# EAGLE design Raspberry Pi IMU shield_vFinal (EAGLE 8.7.0)
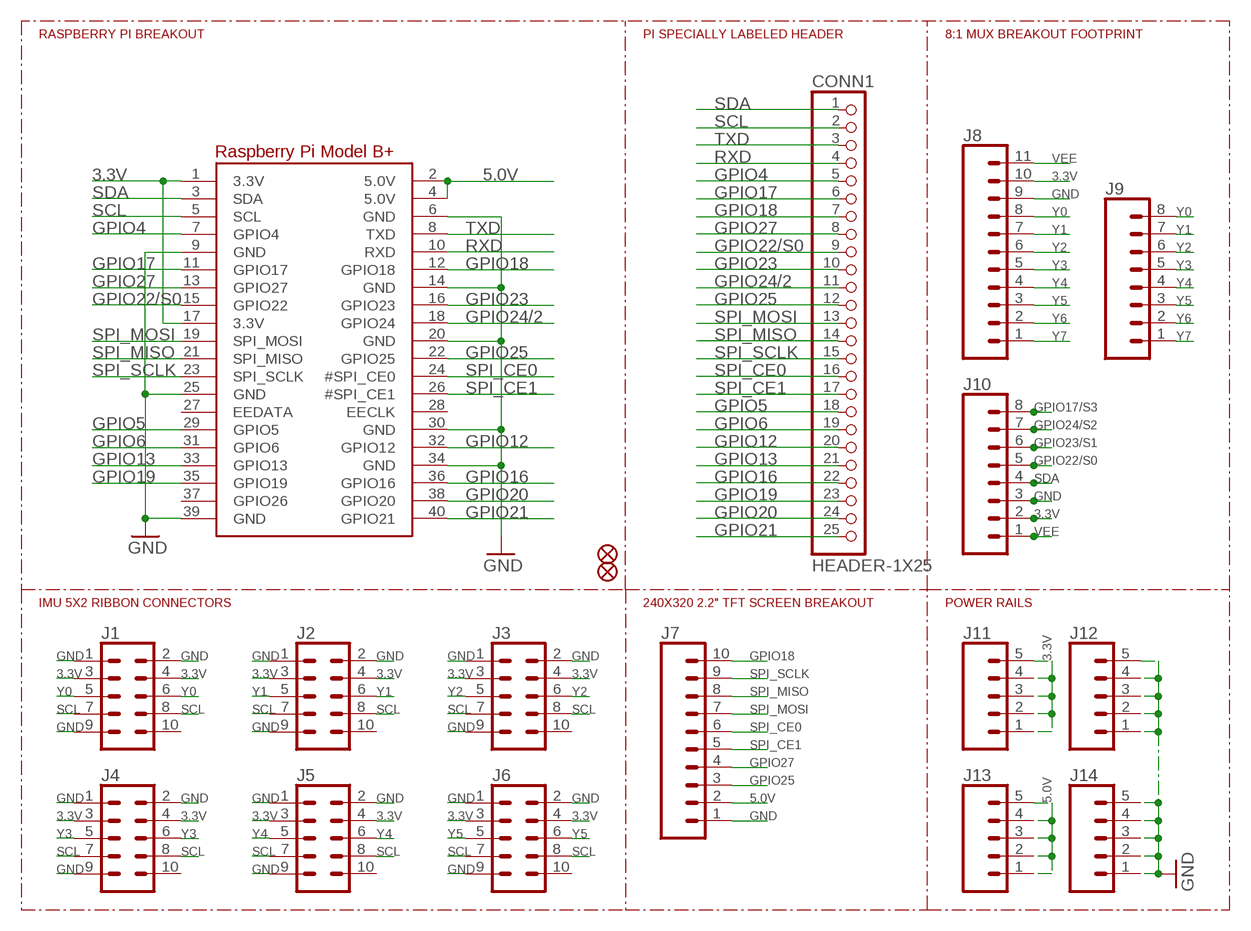
[diagram p0: schematic, sheet 1]

## Parts
CONN1  HEADER-1X25  [1X25_ROUND_70MIL]
FID2  FIDUCIAL""  [FIDUCIAL_1MM]
FID3  FIDUCIAL""  [FIDUCIAL_1MM]
J1  CONN_05X2SHD  [2X5-SHROUDED]
J2  CONN_05X2SHD  [2X5-SHROUDED]
J3  CONN_05X2SHD  [2X5-SHROUDED]
J4  CONN_05X2SHD  [2X5-SHROUDED]
J5  CONN_05X2SHD  [2X5-SHROUDED]
J6  CONN_05X2SHD  [2X5-SHROUDED]
J7  CONN_10LOCK  [1X10_LOCK]
J8  CONN_111X11_NO_SILK_KIT  [1X11_NO_SILK_KIT]
J9  CONN_08NO_SILK_FEMALE_PTH  [1X08_NO_SILK]
J10  CONN_08NO_SILK_FEMALE_PTH  [1X08_NO_SILK]
J11  CONN_05  [1X05]
J12  CONN_05  [1X05]
J13  CONN_05  [1X05]
J14  CONN_05  [1X05]
RPI1  RASPBERRYPI_BPLUS_HATNOSLOTS  [PI_HAT_NOSLOTS]

## Nets
3.3V [power]: J1.3 J1.4 J2.3 J2.4 J3.3 J3.4 J4.3 J4.4 J5.3 J5.4 J6.3 J6.4 J8.10 J10.2 J11.1 J11.2 J11.3 J11.4 J11.5 RPI1.1(3.3V) RPI1.17(3.3V)
5.0V [power]: J7.2 J13.1 J13.2 J13.3 J13.4 J13.5 RPI1.2(5.0V) RPI1.4(5.0V)
GND [power]: J1.1 J1.2 J1.9 J2.1 J2.2 J2.9 J3.1 J3.2 J3.9 J4.1 J4.2 J4.9 J5.1 J5.2 J5.9 J6.1 J6.2 J6.9 J7.1 J8.9 J10.3 J12.1 J12.2 J12.3 J12.4 J12.5 J14.1 J14.2 J14.3 J14.4 J14.5 RPI1.6(GND) RPI1.9(GND) RPI1.14(GND) RPI1.20(GND) RPI1.25(GND) RPI1.30(GND) RPI1.34(GND) RPI1.39(GND)
GPIO4: CONN1.5 RPI1.7(GPIO4)
GPIO5: CONN1.18 RPI1.29(GPIO5)
GPIO6: CONN1.19 RPI1.31(GPIO6)
GPIO12: CONN1.20 RPI1.32(GPIO12)
GPIO13: CONN1.21 RPI1.33(GPIO13)
GPIO16: CONN1.22 RPI1.36(GPIO16)
GPIO17: CONN1.6 RPI1.11(GPIO17)
GPIO17/S3: J10.8
GPIO18: CONN1.7 J7.10 RPI1.12(GPIO18)
GPIO19: CONN1.23 RPI1.35(GPIO19)
GPIO20: CONN1.24 RPI1.38(GPIO20)
GPIO21: CONN1.25 RPI1.40(GPIO21)
GPIO22/S0: CONN1.9 J10.5 RPI1.15(GPIO22)
GPIO23: CONN1.10 RPI1.16(GPIO23)
GPIO23/S1: J10.6
GPIO24/2: CONN1.11 RPI1.18(GPIO24)
GPIO24/S2: J10.7
GPIO25: CONN1.12 J7.3 RPI1.22(GPIO25)
GPIO27: CONN1.8 J7.4 RPI1.13(GPIO27)
RXD: CONN1.4 RPI1.10(RXD)
SCL: CONN1.2 J1.7 J1.8 J2.7 J2.8 J3.7 J3.8 J4.7 J4.8 J5.7 J5.8 J6.7 J6.8 RPI1.5(SCL)
SDA: CONN1.1 J10.4 RPI1.3(SDA)
SPI_CE0: CONN1.16 J7.6 RPI1.24(#SPI_CE0)
SPI_CE1: CONN1.17 J7.5 RPI1.26(#SPI_CE1)
SPI_MISO: CONN1.14 J7.8 RPI1.21(SPI_MISO)
SPI_MOSI: CONN1.13 J7.7 RPI1.19(SPI_MOSI)
SPI_SCLK: CONN1.15 J7.9 RPI1.23(SPI_SCLK)
TXD: CONN1.3 RPI1.8(TXD)
VEE [power]: J8.11 J10.1
Y0 [power]: J1.5 J1.6 J8.8 J9.8
Y1 [power]: J2.5 J2.6 J8.7 J9.7
Y2 [power]: J3.5 J3.6 J8.6 J9.6
Y3 [power]: J4.5 J4.6 J8.5 J9.5
Y4 [power]: J5.5 J5.6 J8.4 J9.4
Y5 [power]: J6.5 J6.6 J8.3 J9.3
Y6 [power]: J8.2 J9.2
Y7 [power]: J8.1 J9.1
Unconnected: J1.10 J2.10 J3.10 J4.10 J5.10 J6.10 RPI1.27(EEDATA) RPI1.28(EECLK) RPI1.37(GPIO26)

## Notes on the sheet
- RASPBERRY PI BREAKOUT | PI SPECIALLY LABELED HEADER | 8:1 MUX BREAKOUT FOOTPRINT
- IMU 5X2 RIBBON CONNECTORS | 240X320 2.2" TFT SCREEN BREAKOUT | POWER RAILS

## Library data of the parts
CONN1 = microbuilder:HEADER-1X25
FID2 FID3 = microbuilder:FIDUCIAL: Fiducial Alignment Points Various fiducial points for machine vision alignment.; BOM: EXCLUDE
J1-J6 = SparkFun-Connectors:CONN_05X2: Multi connection point. Often used as Generic Header-pin footprint for 0.1 inch spaced/style header connections For AVR SPI programming port, see special device with nice symbol: "AVR_SPI_PROG_5x2.dev" You can populate with any combo of single row headers, but if you'd like an exact match, check these: 2x5 AVR ICSP Male Header <https://www.sparkfun.com/products/778> (PRT-00778) 2x5 Pin Shrouded Header <https://www.sparkfun.com/products/8506> (PRT-08506) On any of the 0.1 inch spaced packages, you can populate with these: Break Away Headers - Straight <https://www.sparkfun.com/products/116> (PRT-00116) Break Away Male Headers - Right Angle <https://www.sparkfun.com/products/553> (PRT-00553) Female Headers <https://www.sparkfun.com/products/115> (PRT-00115) Break Away Headers - Machine Pin <https://www.sparkfun.com/products/117> (PRT-00117) Break Away Female Headers - Swiss Machine Pin <https://www.sparkfun.com/products/743> (PRT-00743) Special note: the shrouded connector mates well with our 5x2 ribbon cables: 2x5 Pin IDC Ribbon Cable <https://www.sparkfun.com/products/8535> (PRT-08535); PROD_ID: CONN-08671; SF_ID: PRT-08506
J7 = SparkFun-Connectors:CONN_10: Multi connection point. Often used as Generic Header-pin footprint for 0.1 inch spaced/style header connections On any of the 0.1 inch spaced packages, you can populate with these: Break Away Headers - Straight <https://www.sparkfun.com/products/116> (PRT-00116) Break Away Male Headers - Right Angle <https://www.sparkfun.com/products/553> (PRT-00553) Female Headers <https://www.sparkfun.com/products/115> (PRT-00115) Break Away Headers - Machine Pin <https://www.sparkfun.com/products/117> (PRT-00117) Break Away Female Headers - Swiss Machine Pin <https://www.sparkfun.com/products/743> (PRT-00743) Arduino Stackable Header - 10 Pin <https://www.sparkfun.com/products/11376> (PRT-11376) For SCREWTERMINALS and SPRING TERMINALS visit here: Screw Terimnals on SparkFun.com <https://www.sparkfun.com/search/results?term=Screw+Terminals> (5mm/3.5mm/2.54mm spacing) This device is also useful as a general connection point to wire up your design to another part of your project. Our various solder wires solder well into these plated through hole pads. Hook-Up Wire - Assortment (Stranded, 22 AWG) <https://www.sparkfun.com/products/11375> (PRT-11375) Hook-Up Wire - Assortment (Solid Core, 22 AWG) <https://www.sparkfun.com/products/11367> (PRT-11367) View the entire wire category on our website here <https://www.sparkfun.com/categories/141> Special notes: Molex polarized connector foot print use with SKU : PRT-08231 with associated crimp pins and housings. 1MM SMD Version SKU: PRT-10208 NOTES ON THE VARIANTS LOCK and LOCK_LONGPADS... This footprint was designed to help hold the alignment of a through-hole component (i.e. 6-pin header) while soldering it into place. You may notice that each hole has been shifted either up or down by 0.005 of an inch from it's more standard position (which is a perfectly straight line). This slight alteration caused the pins (the squares in the middle) to touch the edges of the holes. Because they are alternating, it causes a "brace" to hold the component in place. 0.005 has proven to be the perfect amount of "off-center" position when using our standard breakaway headers. Although looks a little odd when you look at the bare footprint, once you have a header in there, the alteration is very hard to notice. Also,if you push a header all the way into place, it is covered up entirely on the bottom side.
J8 = SparkFun-Connectors:CONN_11: Multi connection point. Often used as Generic Header-pin footprint for 0.1 inch spaced/style header connections On any of the 0.1 inch spaced packages, you can populate with these: Break Away Headers - Straight <https://www.sparkfun.com/products/116> (PRT-00116) Break Away Male Headers - Right Angle <https://www.sparkfun.com/products/553> (PRT-00553) Female Headers <https://www.sparkfun.com/products/115> (PRT-00115) Break Away Headers - Machine Pin <https://www.sparkfun.com/products/117> (PRT-00117) Break Away Female Headers - Swiss Machine Pin <https://www.sparkfun.com/products/743> (PRT-00743) For SCREWTERMINALS and SPRING TERMINALS visit here: Screw Terimnals on SparkFun.com <https://www.sparkfun.com/search/results?term=Screw+Terminals> (5mm/3.5mm/2.54mm spacing) This device is also useful as a general connection point to wire up your design to another part of your project. Our various solder wires solder well into these plated through hole pads. Hook-Up Wire - Assortment (Stranded, 22 AWG) <https://www.sparkfun.com/products/11375> (PRT-11375) Hook-Up Wire - Assortment (Solid Core, 22 AWG) <https://www.sparkfun.com/products/11367> (PRT-11367) View the entire wire category on our website here <https://www.sparkfun.com/categories/141>
J9 J10 = SparkFun-Connectors:CONN_08: Multi connection point. Often used as Generic Header-pin footprint for 0.1 inch spaced/style header connections On any of the 0.1 inch spaced packages, you can populate with these: Break Away Headers - Straight <https://www.sparkfun.com/products/116> (PRT-00116) Break Away Male Headers - Right Angle <https://www.sparkfun.com/products/553> (PRT-00553) Female Headers <https://www.sparkfun.com/products/115> (PRT-00115) Break Away Headers - Machine Pin <https://www.sparkfun.com/products/117> (PRT-00117) Break Away Female Headers - Swiss Machine Pin <https://www.sparkfun.com/products/743> (PRT-00743) Arduino Stackable Header - 8 Pin <https://www.sparkfun.com/products/9279> (PRT-09279) For SCREWTERMINALS and SPRING TERMINALS visit here: Screw Terimnals on SparkFun.com <https://www.sparkfun.com/search/results?term=Screw+Terminals> (5mm/3.5mm/2.54mm spacing) This device is also useful as a general connection point to wire up your design to another part of your project. Our various solder wires solder well into these plated through hole pads. Hook-Up Wire - Assortment (Stranded, 22 AWG) <https://www.sparkfun.com/products/11375> (PRT-11375) Hook-Up Wire - Assortment (Solid Core, 22 AWG) <https://www.sparkfun.com/products/11367> (PRT-11367) View the entire wire category on our website here <https://www.sparkfun.com/categories/141> Special notes: Molex polarized connector foot print use with SKU : PRT-08231 with associated crimp pins and housings. 1MM SMD Version SKU: PRT-10208 NOTES ON THE VARIANTS LOCK and LOCK_LONGPADS... This footprint was designed to help hold the alignment of a through-hole component (i.e. 6-pin header) while soldering it into place. You may notice that each hole has been shifted either up or down by 0.005 of an inch from it's more standard position (which is a perfectly straight line). This slight alteration caused the pins (the squares in the middle) to touch the edges of the holes. Because they are alternating, it causes a "brace" to hold the component in place. 0.005 has proven to be the perfect amount of "off-center" position when using our standard breakaway headers. Although looks a little odd when you look at the bare footprint, once you have a header in there, the alteration is very hard to notice. Also,if you push a header all the way into place, it is covered up entirely on the bottom side.; PROD_ID: CONN-08438
J11-J14 = SparkFun-Connectors:CONN_05: Multi connection point. Often used as Generic Header-pin footprint for 0.1 inch spaced/style header connections On any of the 0.1 inch spaced packages, you can populate with these: Break Away Headers - Straight <https://www.sparkfun.com/products/116> (PRT-00116) Break Away Male Headers - Right Angle <https://www.sparkfun.com/products/553> (PRT-00553) Female Headers <https://www.sparkfun.com/products/115> (PRT-00115) Break Away Headers - Machine Pin <https://www.sparkfun.com/products/117> (PRT-00117) Break Away Female Headers - Swiss Machine Pin <https://www.sparkfun.com/products/743> (PRT-00743) For SCREWTERMINALS and SPRING TERMINALS visit here: Screw Terimnals on SparkFun.com <https://www.sparkfun.com/search/results?term=Screw+Terminals> (5mm/3.5mm/2.54mm spacing) This device is also useful as a general connection point to wire up your design to another part of your project. Our various solder wires solder well into these plated through hole pads. Hook-Up Wire - Assortment (Stranded, 22 AWG) <https://www.sparkfun.com/products/11375> (PRT-11375) Hook-Up Wire - Assortment (Solid Core, 22 AWG) <https://www.sparkfun.com/products/11367> (PRT-11367) View the entire wire category on our website here <https://www.sparkfun.com/categories/141> Special notes: Molex polarized connector foot print use with SKU : PRT-08231 with associated crimp pins and housings. 1MM SMD Version SKU: PRT-10208
RPI1 = microbuilder:RASPBERRYPI_BPLUS

## Net classes
0 default: width 0.254 mm, clearance 0.203 mm
1 power: width 0.406 mm, clearance 0.203 mm

## Board
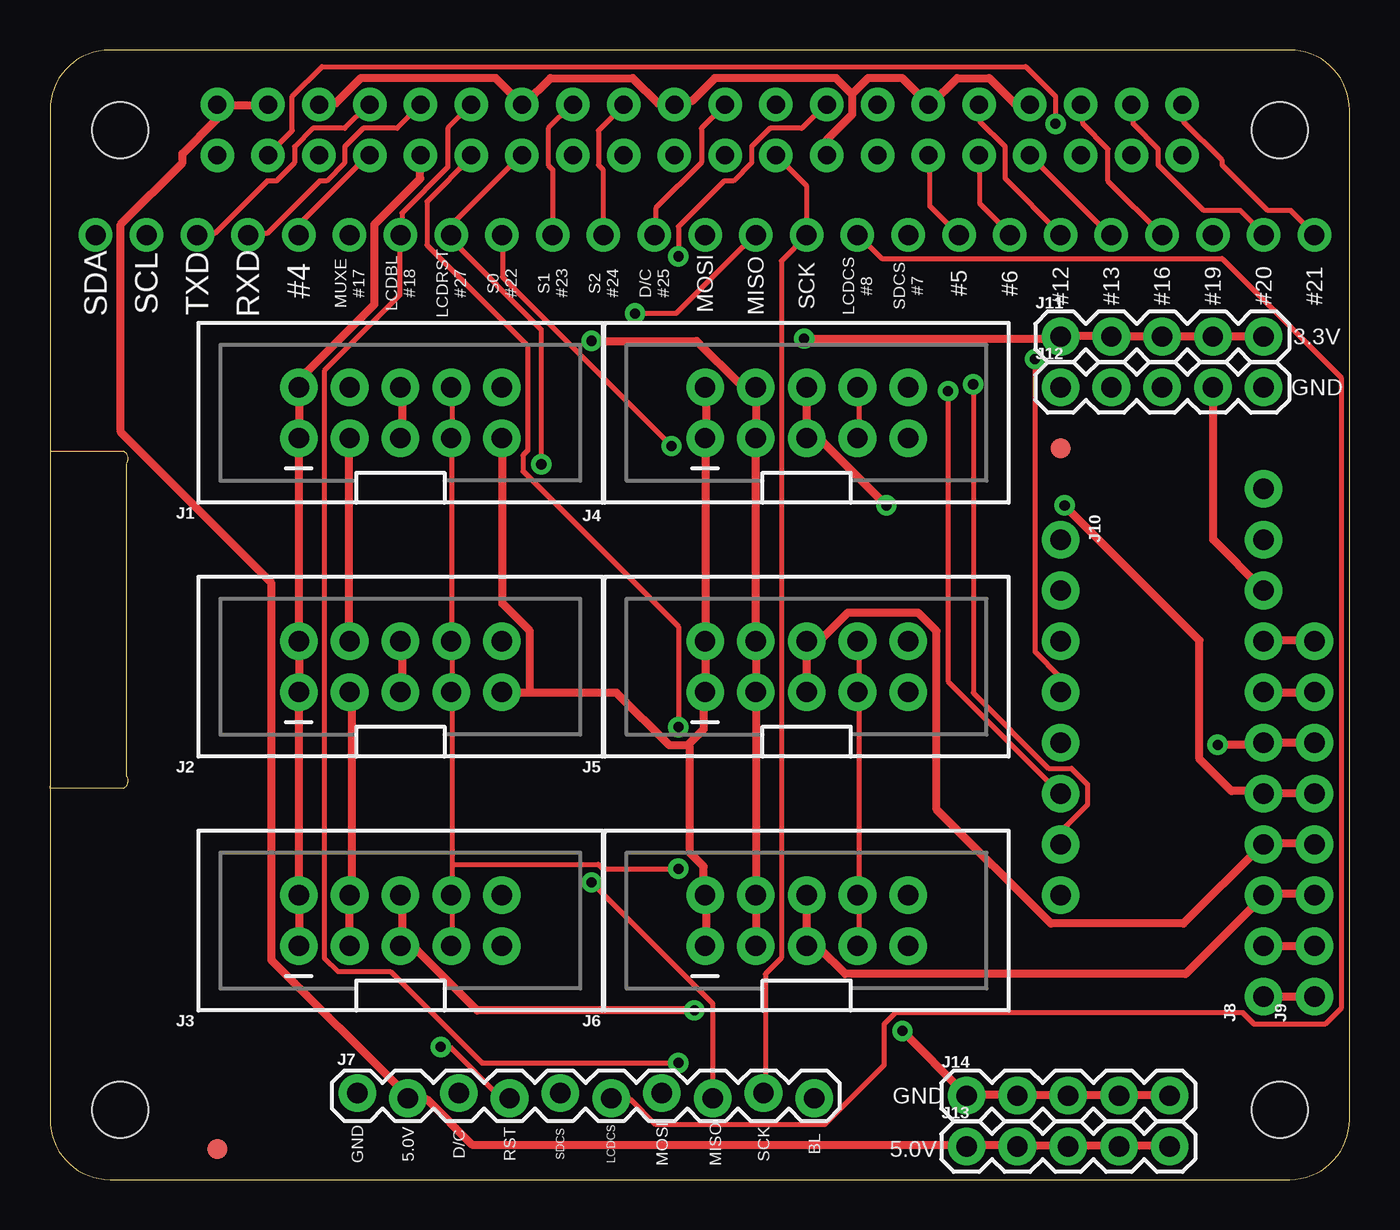
[diagram p1: board, top side]
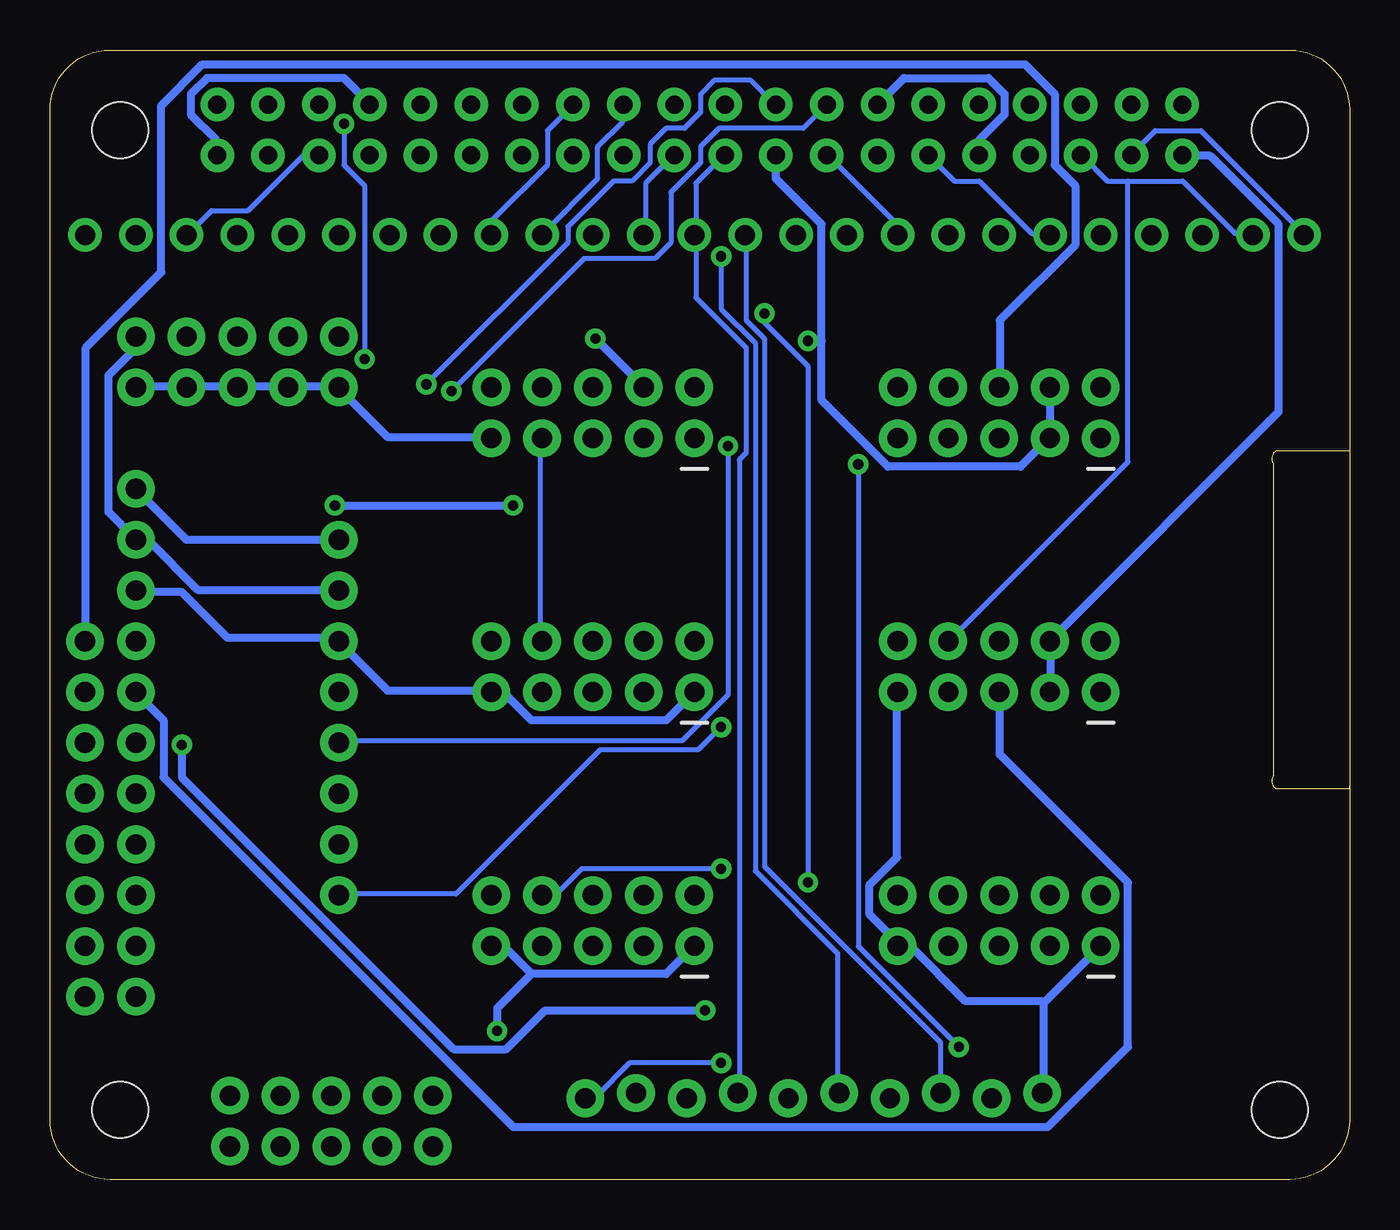
[diagram p2: board, bottom side, seen from below]

Size 65 x 56.5 mm. Coordinates in mm from the lower left corner, seen from the top.
Outline: 0,36.45 3.68,36.45 arc-90 3.81,35.81 3.81,20.19 arc-90 3.68,19.56 0,19.56 0,19.68
Copper layers (1*16): Top 0.035mm / dielectric 1.5mm / Bottom 0.035mm
Design rules "SparkFun": minimum track width 8mil, minimum drill 20mil, track to track 8mil, track to pad 8mil, pad to pad 8mil, via to via 8mil, smd to smd 8mil, copper to edge 10mil, drill to drill 8mil, minimum pad ring 12mil, minimum via ring 10mil, stop-mask expansion 4mil, vias tented up to drill 25mil, thermal gap 10mil

### Footprints (pad centres in the part's own frame; a part is rotated, then mirrored left to right if it is on the bottom)
1X25_ROUND_70MIL = drill 1 pad 1.676: 1 -30.48,0; 2 -27.94,0; 3 -25.4,0; 4 -22.86,0; 5 -20.32,0; 6 -17.78,0; 7 -15.24,0; 8 -12.7,0; 9 -10.16,0; 10 -7.62,0; 11 -5.08,0; 12 -2.54,0; 13 0,0; 14 2.54,0; 15 5.08,0; 16 7.62,0; 17 10.16,0; 18 12.7,0; 19 15.24,0; 20 17.78,0; 21 20.32,0; 22 22.86,0; 23 25.4,0; 24 27.94,0; 25 30.48,0
FIDUCIAL_1MM = smd 1 x 1: 1 0,0
2X5-SHROUDED = drill 1.016 pad 1.88: 1 -1.27,5.08; 2 1.27,5.08; 3 -1.27,2.54; 4 1.27,2.54; 5 -1.27,0; 6 1.27,0; 7 -1.27,-2.54; 8 1.27,-2.54; 9 -1.27,-5.08; 10 1.27,-5.08
1X10_LOCK = drill 1.016 pad 1.88: 1 0,0.127; 2 2.54,-0.127; 3 5.08,0.127; 4 7.62,-0.127; 5 10.16,0.127; 6 12.7,-0.127; 7 15.24,0.127; 8 17.78,-0.127; 9 20.32,0.127; 10 22.86,-0.127
1X11_NO_SILK_KIT = drill 1.016 pad 1.88: 1 0,0; 2 2.54,0; 3 5.08,0; 4 7.62,0; 5 10.16,0; 6 12.7,0; 7 15.24,0; 8 17.78,0; 9 20.32,0; 10 22.86,0; 11 25.4,0
1X08_NO_SILK = drill 1.016 pad 1.88: 1 0,0; 2 2.54,0; 3 5.08,0; 4 7.62,0; 5 10.16,0; 6 12.7,0; 7 15.24,0; 8 17.78,0
1X05 = drill 1.016 pad 1.88: 1 0,0; 2 2.54,0; 3 5.08,0; 4 7.62,0; 5 10.16,0
PI_HAT_NOSLOTS = drill 0.9 pad 1.676: 1 8.37,51.23; 2 8.37,53.77; 3 10.91,51.23; 4 10.91,53.77; 5 13.45,51.23; 6 13.45,53.77; 7 15.99,51.23; 8 15.99,53.77; 9 18.53,51.23; 10 18.53,53.77; 11 21.07,51.23; 12 21.07,53.77; 13 23.61,51.23; 14 23.61,53.77; 15 26.15,51.23; 16 26.15,53.77; 17 28.69,51.23; 18 28.69,53.77; 19 31.23,51.23; 20 31.23,53.77; 21 33.77,51.23; 22 33.77,53.77; 23 36.31,51.23; 24 36.31,53.77; 25 38.85,51.23; 26 38.85,53.77; 27 41.39,51.23; 28 41.39,53.77; 29 43.93,51.23; 30 43.93,53.77; 31 46.47,51.23; 32 46.47,53.77; 33 49.01,51.23; 34 49.01,53.77; 35 51.55,51.23; 36 51.55,53.77; 37 54.09,51.23; 38 54.09,53.77; 39 56.63,51.23; 40 56.63,53.77 | hole 2.8: 3.5,3.5; 3.5,52.5; 61.5,52.5; 61.5,3.5

### Placement (x,y rotation side)
CONN1  32.77,47.24 0 top
FID2  8.38,1.52 0 top
FID3  50.55,36.58 0 top
J1  17.53,38.35 90 top
J2  17.53,25.65 90 top
J3  17.53,12.95 90 top
J4  37.85,38.35 90 top
J5  37.85,25.65 90 top
J6  37.85,12.95 90 top
J7  15.37,4.19 0 top
J8  60.71,9.14 90 top
J9  63.25,9.14 90 top
J10  50.55,32 270 top
J11  50.55,42.16 0 top
J12  50.55,39.62 0 top
J13  45.85,1.65 0 top
J14  45.85,4.19 0 top
RPI1  0,0 0 top

### Tracks (layer width: path | path; a pad name or v marks a point on that pad's centre or on a via)
3.3V  (via drill 0.51)
  Top 0.406: J11.5 60.69,42.18 58.29,42.18 J11.4 58.06,42.18 55.78,42.18 J11.3 55.55,42.18 53.26,42.18 J11.2 53.03,42.18 50.63,42.18 J11.1 50.41,42.06 v37.72,42.06 | J6.3 35.32,11.77 35.32,14.17 J6.4 35.32,14.4 35.32,24.23 J5.3 35.32,24.46 35.32,26.86 J5.4 35.32,27.09 35.32,36.92 J4.3 35.32,37.15 35.32,39.55 J4.4 35.2,39.78 34.52,39.78 32.35,41.95 v27.09,41.95 | J3.3 14.97,11.77 14.97,14.17 J3.4 15.09,14.4 15.09,24.35 J2.3 | J1.3 14.97,37.03 14.97,26.98 J2.4
  Bottom 0.406: J10.2 50.63,29.49 57.61,29.49 60.12,32 J8.10 60.81,32.12 62.06,33.38 62.06,40.23 60.81,41.49 60.81,42.06 J11.5 | v37.72,42.06 35.32,39.66 J4.4 | 26.4,41.95 26.4,38.98 23.09,35.66 16.46,35.66 15.09,37.03 J1.3 14.97,37.26 14.97,39.55 J1.4 | 26.4,41.95 26.4,47.78 28.69,50.06 28.69,51.21 RPI1.17 | RPI1.1 8.34,51.21 6.97,51.21 3.54,47.78 3.54,38.41 14.97,26.98 J2.4 14.97,26.75 14.97,24.46 J2.3 | 26.4,41.95 v27.09,41.95
5.0V
  Top 0.406: RPI1.4 10.86,53.72 8.46,53.72 RPI1.2 8.34,53.61 8.34,53.03 6.63,51.32 6.63,50.86 3.54,47.78 3.54,37.38 11.09,29.83 11.09,10.97 17.83,4.23 J7.2 17.95,4 18.86,4 21.14,1.71 45.72,1.71 J13.1 45.95,1.71 48.35,1.71 J13.2 48.58,1.71 50.86,1.71 J13.3 51.09,1.71 53.38,1.71 J13.4 53.61,1.71 56.01,1.71 J13.5
GND  (via drill 0.51)
  Top 0.406: J12.4 58.18,39.55 58.18,32 60.69,29.49 J8.9 | J4.2 32.8,39.55 32.8,37.15 J4.1 32.8,36.92 32.8,27.09 J5.2 32.8,26.86 32.8,24.57 J5.1 32.69,24.35 32.69,22.52 31.89,21.72 | 24,24.35 28.35,24.35 30.98,21.72 31.89,21.72 | 24,24.35 22.63,24.35 J2.9 | 24,24.35 24,27.43 22.63,28.8 22.63,37.03 J1.9 | J14.5 56.01,4.23 53.61,4.23 J14.4 53.38,4.23 51.09,4.23 J14.3 50.86,4.23 48.58,4.23 J14.2 48.35,4.23 45.95,4.23 J14.1 45.72,4.34 v42.63,7.43 | J6.1 32.8,11.77 32.8,14.17 J6.2 32.69,14.4 32.69,15.66 32,16.34 32,21.6 31.89,21.72 | RPI1.6 13.49,53.84 14.29,53.84 15.54,55.09 22.29,55.09 23.55,53.84 RPI1.14 23.77,53.84 25.03,55.09 29.15,55.09 30.4,53.84 31.2,53.84 RPI1.20 31.32,53.95 32.12,53.95 33.26,55.09 39.32,55.09 40.12,54.29 | 40.12,54.29 40.12,53.26 38.86,52.01 38.86,51.32 RPI1.25 | 40.12,54.29 40.92,55.09 42.63,55.09 43.89,53.84 RPI1.30 44.12,53.84 45.38,55.09 46.98,55.09 48.23,53.84 48.92,53.84 RPI1.34 | J3.1 12.46,11.77 12.46,14.17 J3.2 12.46,14.4 12.46,24.23 J2.1 12.46,24.46 12.46,26.86 J2.2 12.46,27.09 12.46,36.92 J1.1 12.46,37.15 12.46,39.55 J1.2 12.57,39.78 12.57,40.12 16.23,43.78 16.23,47.78 18.52,50.06 18.52,51.21 RPI1.9
  Bottom 0.406: J4.9 42.98,37.15 48.12,37.15 50.52,39.55 J12.1 50.75,39.66 53.03,39.66 J12.2 53.26,39.66 55.55,39.66 J12.3 55.78,39.66 58.06,39.66 J12.4 58.29,39.66 60.69,39.66 J12.5 | J8.9 60.69,29.38 58.41,29.38 56.12,27.09 50.63,27.09 J10.3 50.52,26.86 48.12,24.46 42.98,24.46 J5.9 42.75,24.35 42.29,24.35 40.92,22.97 34.18,22.97 J5.1 | 40.92,10.29 42.29,11.66 42.86,11.66 J6.9 | 40.92,10.29 34.18,10.29 32.8,11.66 J6.1 | v42.63,7.43 42.63,8.57 40.92,10.29 | RPI1.9 18.52,51.32 18.52,52.01 17.26,53.26 17.26,54.29 18.06,55.09 22.29,55.09 23.55,53.84 RPI1.14 | RPI1.39 56.69,51.32 56.69,52.01 57.95,53.26 57.95,54.29 57.15,55.09 50.29,55.09 49.03,53.84 RPI1.34 | 15.32,8.8 15.32,4.34 J7.1 | 15.32,8.8 12.46,11.66 J3.1 | 15.32,8.8 15.43,8.91 19.2,8.91 21.95,11.66 22.52,11.66 J3.9 22.63,11.89 24,13.26 24,14.74 22.63,16.12 22.63,24.35 J2.9
GPIO4
  Top 0.254: CONN1.5 12.46,47.32 12.46,47.78 15.89,51.21 RPI1.7
GPIO5
  Top 0.254: RPI1.29 44.01,51.21 44.01,48.69 45.38,47.32 CONN1.18
GPIO6
  Top 0.254: RPI1.31 46.52,51.21 46.52,48.81 48.01,47.32 CONN1.19
GPIO12
  Top 0.254: RPI1.32 46.52,53.72 46.52,52.92 47.78,51.66 47.78,50.06 50.52,47.32 CONN1.20
GPIO13
  Top 0.254: RPI1.33 49.03,51.21 53.03,47.21 CONN1.21
GPIO16
  Top 0.254: CONN1.22 52.92,49.95 52.92,51.55 51.66,52.81 51.66,53.72 RPI1.36
GPIO17  (via drill 0.51)
  Top 0.254: v31.43,22.63 31.43,27.66 23.66,35.43 23.66,36.23 23.89,36.46 23.89,41.72 18.86,46.75 18.86,48.92 21.14,51.21 RPI1.11
  Bottom 0.254: CONN1.6 15.09,47.32 15.89,47.32 18.52,49.95 19.77,49.95 21.03,51.21 RPI1.11 | 50.52,14.29 44.69,14.29 37.49,21.49 32.58,21.49 v31.43,22.63
GPIO18  (via drill 0.51)
  Top 0.254: RPI1.12 21.03,53.72 19.89,52.58 19.89,50.63 17.6,48.35 17.6,47.32 CONN1.7 17.49,47.21 17.49,44.23 13.72,40.46 13.72,11.09 14.4,10.4 17.03,10.4 21.6,5.83 v31.43,5.83
  Bottom 0.254: v31.43,5.83 36.01,5.83 37.72,4.12 38.18,4.12 J7.10
GPIO19
  Bottom 0.254: RPI1.35 51.66,51.21 52.35,51.21 55.09,48.46 56.92,48.46 58.06,47.32 CONN1.23
GPIO20
  Top 0.254: RPI1.38 54.18,53.72 54.18,52.81 55.44,51.55 55.44,50.75 57.72,48.46 59.55,48.46 60.69,47.32 CONN1.24
GPIO21
  Top 0.254: RPI1.40 56.69,53.72 56.69,52.92 58.64,50.98 58.64,50.75 60.92,48.46 62.06,48.46 63.21,47.32 CONN1.25
GPIO22/S0  (via drill 0.51)
  Top 0.254: v31.09,36.69 22.63,45.15 22.63,47.21 CONN1.9
  Bottom 0.254: CONN1.9 22.63,47.32 22.63,47.78 26.06,51.21 RPI1.15 | v31.09,36.69 31.09,24.23 33.38,21.95 50.52,21.95 J10.5
GPIO23  (via drill 0.51)
  Top 0.254: CONN1.10 25.15,50.52 24.92,50.75 24.92,52.58 26.06,53.72 RPI1.16 | 50.52,19.32 44.92,24.92 v44.92,39.43
  Bottom 0.254: v44.92,39.43 38.29,46.06 34.75,46.06 33.95,46.86 33.95,49.38 32.46,50.86 32.46,51.66 31.55,52.58 27.32,52.58 26.18,53.72 RPI1.16
GPIO24/2  (via drill 0.51)
  Top 0.254: CONN1.11 27.66,47.32 27.66,50.52 27.43,50.75 27.43,52.46 28.69,53.72 RPI1.18 | 50.63,16.8 50.63,17.49 51.89,18.75 51.89,19.77 51.09,20.57 49.95,20.57 46.18,24.35 v46.18,39.78
  Bottom 0.254: v46.18,39.78 39.09,46.86 39.09,47.66 36.8,49.95 35.89,49.95 34.98,50.86 34.98,51.78 34.18,52.58 33.26,52.58 32.46,53.38 32.46,54.29 31.77,54.98 29.95,54.98 28.8,53.84 RPI1.18
GPIO25
  Top 0.254: CONN1.12 30.29,47.32 30.29,48.58 32.58,50.86 32.58,52.58 33.72,53.72 RPI1.22
  Bottom 0.254: J7.3 20.46,4.34 20.46,6.86 29.26,15.66 29.26,42.06 30.18,42.98 30.18,47.21 CONN1.12
GPIO27  (via drill 0.51)
  Top 0.254: RPI1.13 23.55,51.21 20.12,47.78 20.12,47.32 CONN1.8 20.12,47.21 20.12,46.98 24.57,42.52 v24.57,35.78 | v19.55,6.63 20,6.63 22.52,4.12 22.97,4.12 J7.4
  Bottom 0.254: v19.55,6.63 24.57,11.66 v24.57,35.78
RXD
  Top 0.254: CONN1.4 9.94,47.32 10.86,47.32 13.49,49.95 13.83,49.95 14.74,50.86 14.74,51.66 15.66,52.58 17.37,52.58 18.52,53.72 RPI1.10
SCL  (via drill 0.51)
  Top 0.254: J4.7 40.46,37.15 40.46,39.55 J4.8 | J6.7 40.46,11.77 40.46,14.17 J6.8 40.46,14.29 40.46,24.35 J5.7 40.46,24.46 40.46,26.86 J5.8 | J1.8 20.12,39.55 20.12,37.15 J1.7 20.12,37.03 20.12,26.98 J2.8 20.12,26.86 20.12,24.46 J2.7 20.12,24.35 20.12,15.77 | J3.7 20.12,11.77 20.12,14.17 J3.8 20.12,14.29 20.12,15.77 | v31.43,15.54 27.66,15.54 27.43,15.77 20.12,15.77
  Bottom 0.254: J4.7 40.46,37.03 40.46,26.98 J5.8 | 11.09,49.95 12.12,49.95 13.37,51.21 RPI1.5 | 11.09,49.95 8.34,49.95 5.71,47.32 4.92,47.32 CONN1.2 | 11.09,49.95 11.09,35.89 20,26.98 J2.8 | v31.43,15.54 38.41,15.54 39.66,14.29 40.35,14.29 J6.8
SDA  (via drill 0.51)
  Top 0.254: v49.26,41.03 49.26,26.4 50.52,25.15 50.52,24.46 J10.4 | v50.29,52.81 50.29,54.18 48.81,55.66 13.6,55.66 12.12,54.18 12.12,52.46 10.97,51.32 RPI1.3
  Bottom 0.254: CONN1.1 2.29,47.32 7.43,52.46 9.72,52.46 10.86,51.32 RPI1.3 | v49.26,41.03 49.26,49.72 50.29,50.75 v50.29,52.81
SPI_CE0
  Top 0.254: J7.6 28.12,4 29.03,4 30.29,2.74 38.75,2.74 41.72,5.71 41.72,7.77 42.29,8.34 59.66,8.34 60.24,7.77 63.78,7.77 64.58,8.57 64.58,40.12 58.64,46.06 41.6,46.06 40.46,47.21 CONN1.16
  Bottom 0.254: RPI1.24 36.35,53.72 36.35,52.92 37.6,51.66 37.6,50.06 40.35,47.32 CONN1.16
SPI_CE1  (via drill 0.51)
  Top 0.254: v31.43,46.18 31.43,47.66 33.72,49.95 34.18,49.95 35.09,50.86 35.09,51.66 36.01,52.58 37.6,52.58 38.75,53.72 RPI1.26
  Bottom 0.254: CONN1.17 42.86,47.32 42.86,48.01 40.12,50.75 40.12,52.46 38.86,53.72 RPI1.26 | v31.43,46.18 31.43,43.55 29.72,41.83 29.72,15.43 25.6,11.32 25.6,4.34 J7.5
SPI_MISO  (via drill 0.51)
  Top 0.254: J7.8 33.15,8.8 v27.09,14.86 | v29.26,43.32 31.32,43.32 35.2,47.21 CONN1.14
  Bottom 0.254: CONN1.14 35.2,47.32 35.2,49.84 33.83,51.21 RPI1.21 | v27.09,14.86 27.09,40.69 29.26,42.86 v29.26,43.32
SPI_MOSI
  Bottom 0.254: RPI1.19 31.32,51.21 32.69,49.84 32.69,47.32 CONN1.13 32.69,47.21 32.69,44.12 30.18,41.6 30.18,36.35 30.52,36.01 30.52,4.34 J7.7
SPI_SCLK
  Top 0.254: RPI1.23 36.35,51.21 37.83,49.72 37.83,47.32 CONN1.15 37.83,47.21 36.58,45.95 36.58,11.09 35.78,10.29 35.78,4.34 J7.9
TXD
  Top 0.254: CONN1.3 7.43,47.32 8.23,47.32 10.86,49.95 11.32,49.95 12.23,50.86 12.23,51.66 13.14,52.58 14.74,52.58 15.89,53.72 RPI1.8
VEE
  Bottom 0.406: J10.1 58.18,32 60.69,34.52 J8.11
Y0
  Top 0.406: J1.5 17.6,37.15 17.6,39.55 J1.6 | J8.8 60.81,26.98 63.21,26.98 J9.8
  Bottom 0.406: J1.6 17.49,39.66 17.49,42.98 13.72,46.75 13.72,49.72 14.74,50.75 14.74,54.29 16.23,55.78 57.38,55.78 59.44,53.72 59.44,45.38 63.21,41.6 63.21,26.98 J9.8
Y1
  Top 0.406: J2.5 17.6,24.46 17.6,26.86 J2.6 | J8.7 60.81,24.35 63.21,24.35 J9.7
  Bottom 0.406: J2.5 17.49,24.35 17.49,21.26 11.09,14.86 11.09,6.63 15.09,2.63 41.83,2.63 59.32,20.12 59.32,22.97 60.69,24.35 J8.7
Y2  (via drill 0.51)
  Top 0.406: J3.6 17.6,14.17 17.6,11.77 J3.5 17.72,11.66 18.17,11.66 21.37,8.46 v32.23,8.46 | J9.6 63.21,21.83 60.81,21.83 J8.6 60.22,21.74 v58.41,21.74
  Bottom 0.406: v32.23,8.46 40.23,8.46 42.18,6.51 44.81,6.51 58.41,20.12 v58.41,21.74
Y3  (via drill 0.51)
  Top 0.406: J4.6 37.83,39.55 37.83,37.15 J4.5 37.95,36.92 38.63,36.92 v41.83,33.72 | J9.5 63.21,19.32 60.81,19.32 J8.5 60.58,19.43 59.09,19.43 57.49,21.03 57.49,26.98 v50.75,33.72
  Bottom 0.406: v50.75,33.72 v41.83,33.72
Y4
  Top 0.406: J5.5 37.83,24.46 37.83,26.86 J5.6 37.95,27.09 38.63,27.09 39.89,28.35 43.43,28.35 44.35,27.43 44.35,18.52 50.06,12.8 56.69,12.8 60.58,16.69 J8.4 60.81,16.8 63.21,16.8 J9.4
Y5
  Top 0.406: J6.6 37.83,14.17 37.83,11.77 J6.5 37.95,11.54 38.52,11.54 39.78,10.29 56.81,10.29 60.58,14.06 J8.3 60.81,14.29 63.21,14.29 J9.3
Y6
  Top 0.406: J8.2 60.81,11.66 63.21,11.66 J9.2
Y7
  Top 0.406: J9.1 J8.1

### Text on the board
tPlace: SDA | SCL | TXD | RXD | #4 | MUXE / #17 | LCDBL / #18 | LCDRST / #27 | S0 / #22 | S1 / #23 | S2 / #24 | D/C / #25 | MOSI | MISO | SCK | LCDCS / #8 | SDCS / #7 | #5 | #6 | #12 | #13 | #16 | #19 | #20 | #21 | 3.3V | GND | GND | GND | 5.0V | D/C | RST | SDCS | LCDCS | MOSI | MISO | SCK | BL | 5.0V